# EAGLE schematic motorcircuit (EAGLE 6.1)
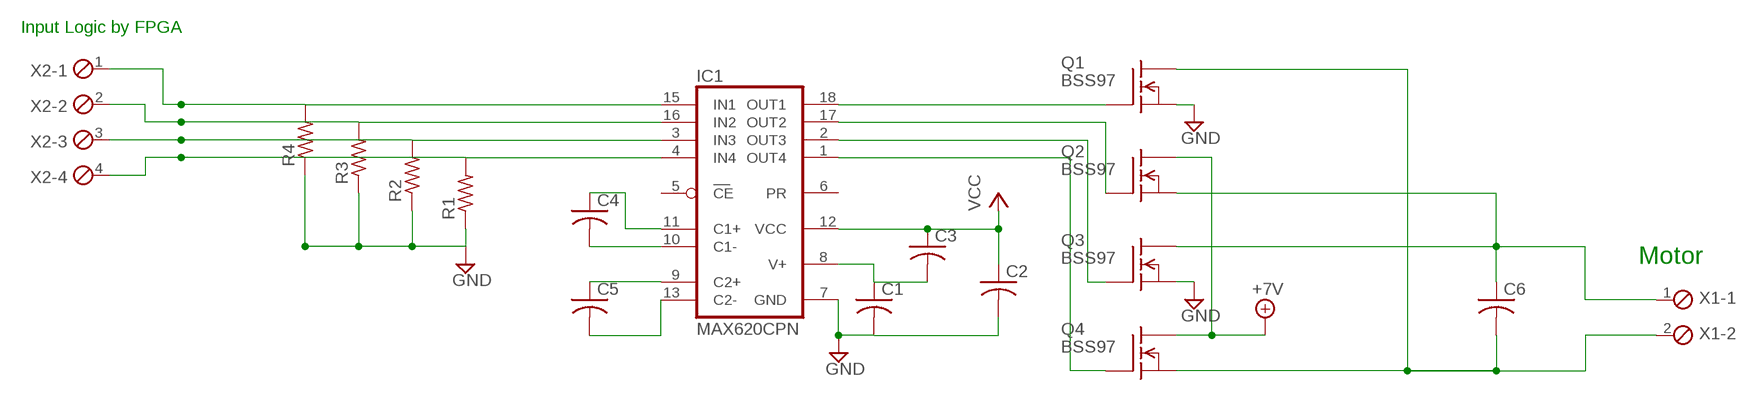
[diagram p0: schematic, sheet 1]

## Parts
C1  C-US025-025X050  [C025-025X050]
C2  C-US025-025X050  [C025-025X050]
C3  C-US025-025X050  [C025-025X050]
C4  C-US025-025X050  [C025-025X050]
C5  C-US025-025X050  [C025-025X050]
C6  C-US025-025X050  [C025-025X050]
IC1  MAX620CPN  [DIL18]
Q1  BSS97  [TO202]
Q2  BSS97  [TO202]
Q3  BSS97  [TO202]
Q4  BSS97  [TO202]
R1  R-US_0204/2V  [0204V]
R2  R-US_0204/2V  [0204V]
R3  R-US_0204/2V  [0204V]
R4  R-US_0204/2V  [0204V]
X1  MPT2  [2POL254]
X2  MPT4  [4POL254]

## Nets
+7V: Q2.2(D) Q4.2(D)
GND: C1.2 C2.2 IC1.7(GND) Q1.1(S) Q3.1(S) R1.1 R2.1 R3.1 R4.1
N$1: IC1.18(OUT1) Q1.3(G)
N$2: IC1.17(OUT2) Q2.3(G)
N$3: IC1.2(OUT3) Q3.3(G)
N$4: IC1.1(OUT4) Q4.3(G)
N$5: IC1.3(IN3) R2.2 X2.3
N$6: IC1.4(IN4) R1.2 X2.4
N$7: C4.2 IC1.10(C1-)
N$8: C4.1 IC1.11(C1+)
N$9: C5.1 IC1.9(C2+)
N$10: C5.2 IC1.13(C2-)
N$11: IC1.16(IN2) R3.2 X2.2
N$12: IC1.15(IN1) R4.2 X2.1
N$13: C6.1 Q2.1(S) Q3.2(D) X1.1
N$14: C6.2 Q1.2(D) Q4.1(S) X1.2
V+: C1.1 C3.2 IC1.8(V+)
VCC: C2.1 C3.1 IC1.12(VCC)
Unconnected: IC1.5(CE) IC1.6(PR)

## Notes on the sheet
- Input Logic by FPGA
- Motor

## Library data of the parts
C1-C6 = resistor:C-US: CAPACITOR, American symbol
IC1 = maxim:MAX620CPN: MOSFET DRIVER; MPN: MAX620CPN+; OC_FARNELL: unknown; OC_NEWARK: 27M4142
Q1-Q4 = transistor-fet:BSS97: N-Channel Enhancement MOSFET 200V; 1.5A; 1,6Ohm
R1-R4 = resistor:R-US_: RESISTOR, American symbol
X1 = con-phoenix-254:MPT2: PHOENIX CONNECTOR; OC_FARNELL: unknown; OC_NEWARK: unknown
X2 = con-phoenix-254:MPT4: PHOENIX CONNECTOR; OC_FARNELL: unknown; OC_NEWARK: unknown